# EAGLE design prisvit (EAGLE 9.6.2)
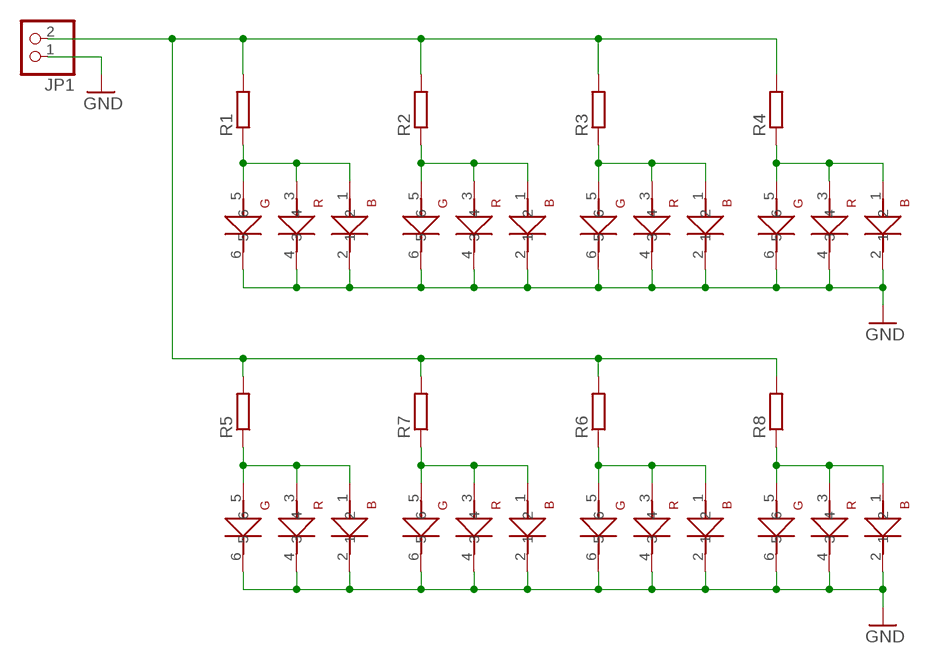
[diagram p0: schematic, sheet 1]

## Parts
JP1  PINHD-1X2  [1X02]
R1  R-EU_M2012  [M2012]
R2  R-EU_M2012  [M2012]
R3  R-EU_M2012  [M2012]
R4  R-EU_M2012  [M2012]
R5  R-EU_M2012  [M2012]
R6  R-EU_M2012  [M2012]
R7  R-EU_M2012  [M2012]
R8  R-EU_M2012  [M2012]
U$1  5050_LED  [5050_LED]
U$2  5050_LED  [5050_LED]
U$3  5050_LED  [5050_LED]
U$4  5050_LED  [5050_LED]
U$5  5050_LED  [5050_LED]
U$6  5050_LED  [5050_LED]
U$7  5050_LED  [5050_LED]
U$8  5050_LED  [5050_LED]

## Nets
GND: JP1.1 U$1.2 U$1.4 U$1.6 U$2.2 U$2.4 U$2.6 U$3.2 U$3.4 U$3.6 U$4.2 U$4.4 U$4.6 U$5.2 U$5.4 U$5.6 U$6.2 U$6.4 U$6.6 U$7.2 U$7.4 U$7.6 U$8.2 U$8.4 U$8.6
N$1: JP1.2 R1.2 R2.2 R3.2 R4.2 R5.2 R6.2 R7.2 R8.2
N$2: R4.1 U$6.1 U$6.3 U$6.5
N$3: R3.1 U$4.1 U$4.3 U$4.5
N$4: R2.1 U$3.1 U$3.3 U$3.5
N$5: R1.1 U$2.1 U$2.3 U$2.5
N$6: R5.1 U$8.1 U$8.3 U$8.5
N$7: R7.1 U$1.1 U$1.3 U$1.5
N$8: R6.1 U$5.1 U$5.3 U$5.5
N$9: R8.1 U$7.1 U$7.3 U$7.5

## Library data of the parts
JP1 = pinhead:PINHD-1X2: PIN HEADER
R1-R8 = rcl:R-EU_: RESISTOR, European symbol; SPICEPREFIX: R
U$1-U$8 = leds:5050_LED

## Board
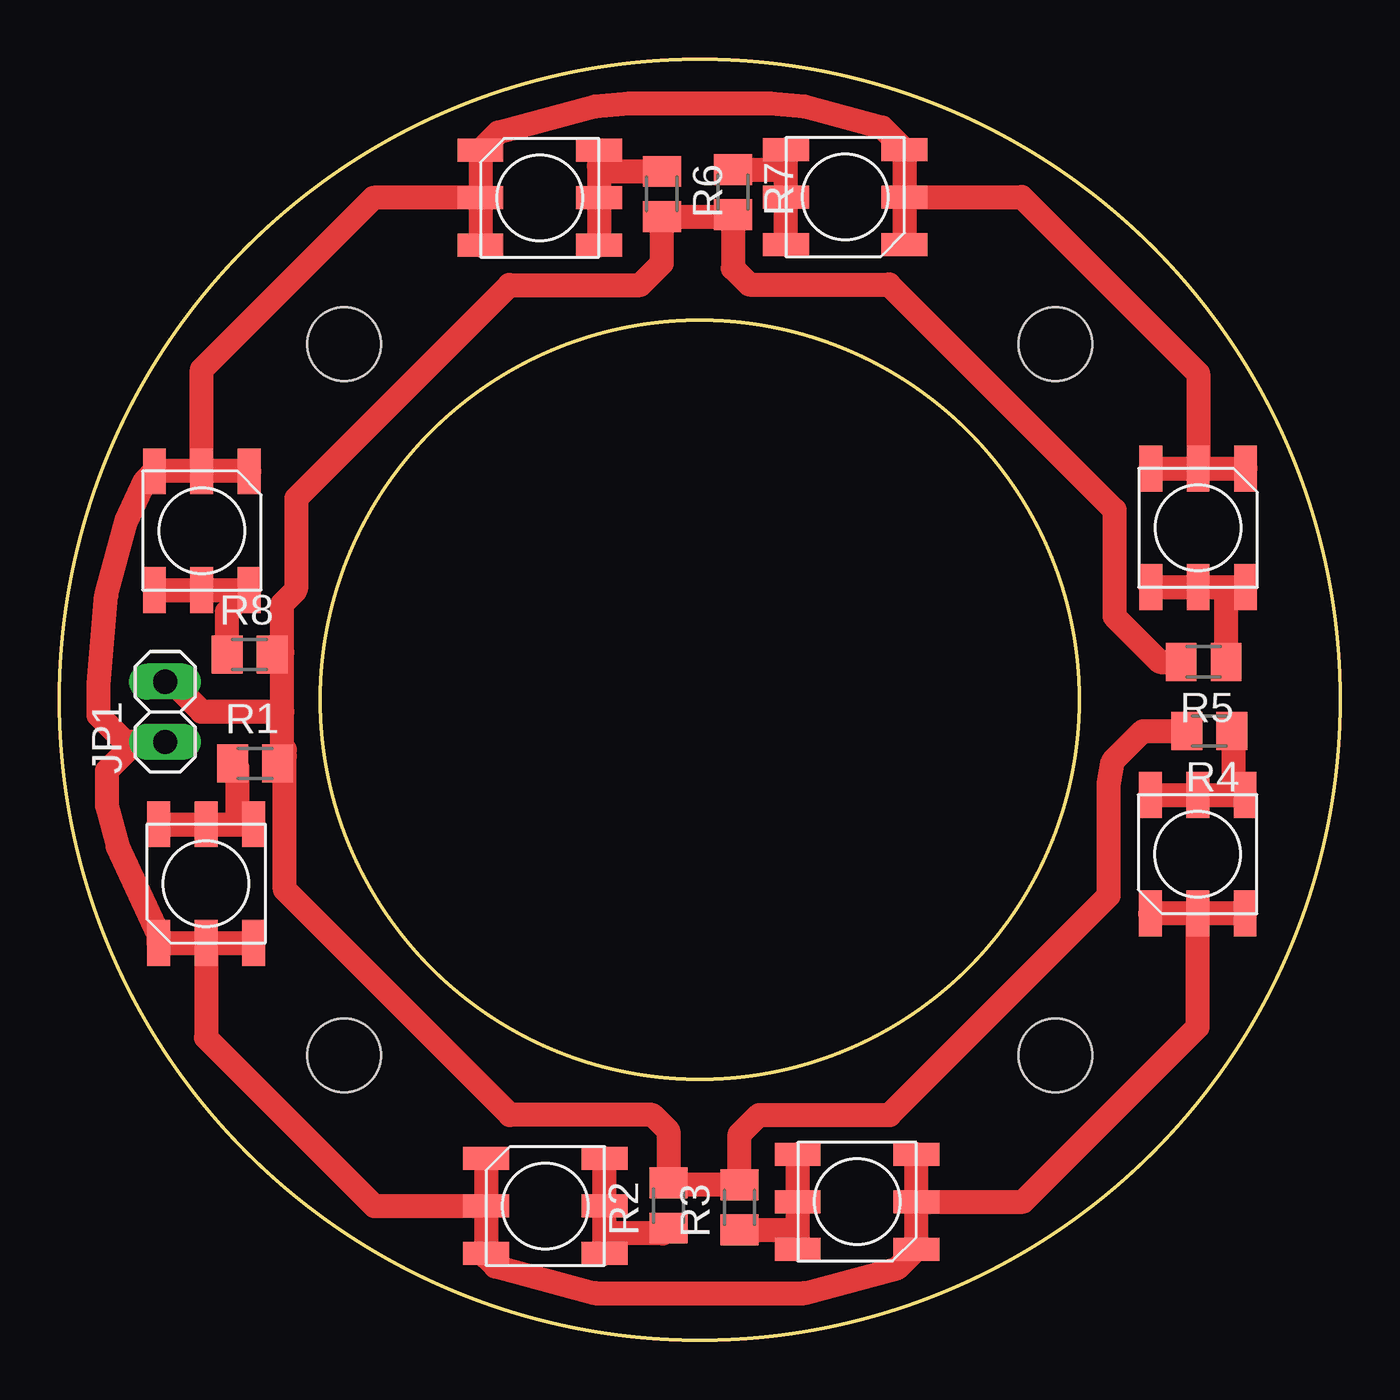
[diagram p1: board, top side]

Size 54 x 54 mm. Coordinates in mm from the lower left corner, seen from the top.
Outline: circle at 27,27 radius 16
Outline: circle at 27,27 radius 27
Copper layers (1*16): Top 0.035mm / dielectric 1.5mm / Bottom 0.035mm
Design rules "default": minimum track width 6mil, minimum drill 0.35mm, track to track 6mil, track to pad 6mil, pad to pad 6mil, via to via 6mil, smd to smd 6mil, copper to edge 40mil, drill to drill 6mil, minimum pad ring 10mil, minimum via ring 8mil, stop-mask expansion 4mil, vias tented up to drill 0mil, thermal gap 10mil
Holes 3.1 mm at 12,42 42,42 42,12 12,12

### Footprints (pad centres in the part's own frame; a part is rotated, then mirrored left to right if it is on the bottom)
1X02 = drill 1.016 long: 1 -1.27,0; 2 1.27,0
M2012 = smd 1.3 x 1.6: 1 -0.95,0; 2 0.95,0
5050_LED = smd 1.93 x 0.965: 1 2.5,2; 2 -2.5,2; 3 2.5,0; 4 -2.5,0; 5 2.5,-2; 6 -2.5,-2

### Placement (x,y rotation side)
JP1  4.46,26.49 90 top
R1  8.26,24.32 0 top
R2  25.68,5.68 90 top
R3  28.68,5.6 90 top
R4  48.48,25.68 180 top
R5  48.24,28.6 180 top
R6  25.4,48.32 270 top
R7  28.4,48.4 270 top
R8  8.02,28.9 0 top
U$1  33.13,48.19 180 top
U$2  6.19,19.25 90 top
U$3  20.49,5.66 0 top
U$4  33.63,5.84 180 top
U$5  20.25,48.16 0 top
U$6  47.99,20.49 90 top
U$7  6.01,34.13 270 top
U$8  48.01,34.25 270 top

### Tracks (layer width: path | path; a pad name or v marks a point on that pad's centre or on a via)
GND
  Top 1.016: U$7.2 U$7.4 | U$7.4 U$7.6 3.62,36.24 2.82,34.51 1.99,31.41 1.66,27.66 1.66,26.34 2.78,25.22 JP1.1 3.22,25.22 2,24 2,22.54 2.46,20.83 4.19,17.12 U$2.2 U$2.4 | U$5.4 U$5.2 18.51,50.92 22.59,52.01 24.03,52.14 29.97,52.14 31.41,52.01 34.68,51.14 U$1.6 U$1.4 | U$5.4 U$5.6 | U$1.4 U$1.2 | U$8.6 U$8.4 | U$8.4 U$8.2 | U$6.6 U$6.4 | U$6.4 U$6.2 | U$4.4 U$4.2 35.33,3.04 31.41,1.99 22.59,1.99 18.39,3.11 17.99,3.51 U$3.6 U$3.4 | U$4.4 U$4.6 | U$3.2 U$3.4 | U$2.4 U$2.6 | U$1.4 40.57,48.19 48.01,40.75 U$8.4 | U$5.4 13.25,48.16 6.01,40.92 U$7.4 | U$2.4 6.19,12.75 13.28,5.66 U$3.4 | U$4.4 40.63,5.84 47.99,13.2 U$6.4
N$1
  Top 1.016: R5.2 46.4,28.6 44.49,30.51 44.49,35 34.98,44.5 29.09,44.5 28.4,45.19 R7.2 28.32,47.37 R6.2 25.4,45.4 24.48,44.48 18.98,44.48 10,35.5 10,31.75 9.94,31.57 9.4,31.04 9.4,29 | 9.4,26.5 6,26.5 4.74,27.76 JP1.2 | 9.4,26.5 9.4,29 | 9.5,24.61 9.5,19 19,9.5 25,9.5 25.68,8.82 R2.2 25.76,6.55 R3.2 28.68,8.68 29.5,9.5 35,9.5 44.25,18.75 44.25,23.46 44.42,24.42 45.68,25.68 R4.2 | 9.4,26.5 | 9.4,26.5 9.4,24.99 9.5,24.89 9.5,24.61 | R8.2 9.07,29 9.4,29 | R1.2 9.5,24.61
N$2
  Top 1.016: U$6.1 U$6.3 49.5,22.99 | 49.5,22.99 U$6.5 | R4.1 49.5,25.61 49.5,22.99
N$3
  Top 1.016: U$4.5 U$4.3 31.13,4.5 | 31.13,4.5 U$4.1 | R3.1 30.98,4.65 31.13,4.5
N$4
  Top 1.016: U$3.5 22.99,4.5 | 22.99,4.5 U$3.3 U$3.1 | R2.1 25.45,4.5 22.99,4.5
N$5
  Top 1.016: U$2.1 U$2.3 7.5,21.75 | 7.5,21.75 U$2.5 | R1.1 7.5,24.13 7.5,21.75
N$6
  Top 1.016: U$8.5 U$8.3 49.5,31.75 | 49.5,31.75 U$8.1 | R5.1 49.19,31.44 49.5,31.75
N$7
  Top 1.016: U$1.1 U$1.3 30.63,49 | 30.63,49 U$1.5 | R7.1 30.28,49.35 30.63,49
N$8
  Top 1.016: U$5.1 22.75,49.5 | 22.75,49.5 U$5.3 U$5.5 | R6.1 22.98,49.27 22.75,49.5
N$9
  Top 1.016: U$7.5 U$7.3 U$7.1 | U$7.1 | R8.1 7.07,30.7 U$7.1